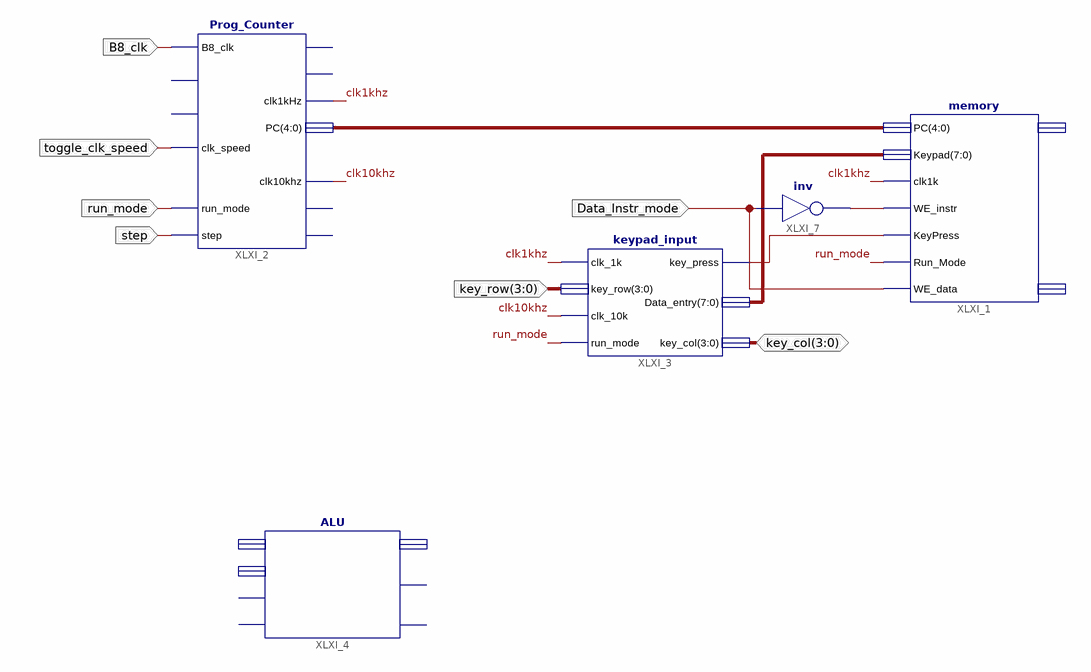
[diagram p0: schematic sheet 1]
// Xilinx ISE schematic final_v1.sch (spartan3e) as structural Verilog: 5 symbols, 7 ports
module final_v1 (
  input  B8_clk,
  input  toggle_clk_speed,
  input  [3:0] key_row,
  input  Data_Instr_mode,
  input  run_mode,
  input  step,
  inout  [3:0] key_col
);

  wire clk1khz, clk10khz, XLXN_3, XLXN_14;
  wire [4:0] XLXN_1;
  wire [7:0] XLXN_2;

  Prog_Counter XLXI_2 (
    .B8_clk(B8_clk), .clk_speed(toggle_clk_speed), .clk1kHz(clk1khz), .clk10khz(clk10khz), .PC(XLXN_1),
    .run_mode(run_mode), .step(step));  // open: HLT, RST, clk1Hz, clk1MHz, quarter_clk, half_clk
  ALU XLXI_4 ();  // open: Reg_A, Reg_B, Subtract, Signed, Accumulator, Negative_S_reg, Overflow_S_reg
  memory XLXI_1 (
    .PC(XLXN_1), .Keypad(XLXN_2), .clk1k(clk1khz), .WE_instr(XLXN_14), .KeyPress(XLXN_3),
    .Run_Mode(run_mode), .WE_data(Data_Instr_mode));  // open: Instr_Out, Data_Out
  keypad_input XLXI_3 (
    .clk_1k(clk1khz), .key_row(key_row), .clk_10k(clk10khz), .run_mode(run_mode), .key_col(key_col),
    .key_press(XLXN_3), .Data_entry(XLXN_2));
  not XLXI_7 (XLXN_14, Data_Instr_mode);
endmodule
